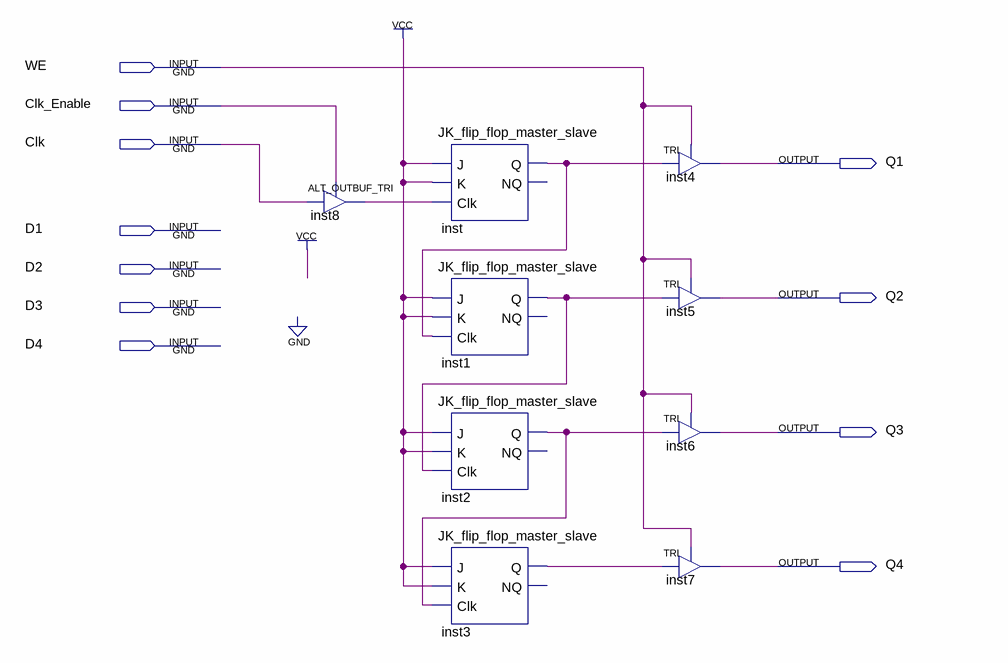
[diagram p0: schematic sheet]
// Quartus schematic PC.bdf as structural Verilog: 9 symbols, 11 pins
module PC (
  input  WE,
  input  Clk_Enable,
  input  Clk,
  input  D1,
  input  D2,
  input  D3,
  input  D4,
  output Q1,
  output Q2,
  output Q3,
  output Q4
);

  wire inst1_q, inst2_q, inst3_q, inst8_o, inst_q;

  ALT_OUTBUF_TRI inst8 (.i(Clk), .oe(Clk_Enable), .o(inst8_o));
  JK_flip_flop_master_slave inst (.J(1'b1), .K(1'b1), .Clk(inst8_o), .Q(inst_q));  // open: NQ
  JK_flip_flop_master_slave inst1 (.J(1'b1), .K(1'b1), .Clk(inst_q), .Q(inst1_q));  // open: NQ
  JK_flip_flop_master_slave inst2 (.J(1'b1), .K(1'b1), .Clk(inst1_q), .Q(inst2_q));  // open: NQ
  JK_flip_flop_master_slave inst3 (.J(1'b1), .K(1'b1), .Clk(inst2_q), .Q(inst3_q));  // open: NQ
  TRI inst4 (.IN(inst_q), .OE(WE), .OUT(Q1));
  TRI inst5 (.IN(inst1_q), .OE(WE), .OUT(Q2));
  TRI inst6 (.IN(inst2_q), .OE(WE), .OUT(Q3));
  TRI inst7 (.IN(inst3_q), .OE(WE), .OUT(Q4));
endmodule
